# EAGLE design HotPotato (EAGLE 8.6.1)
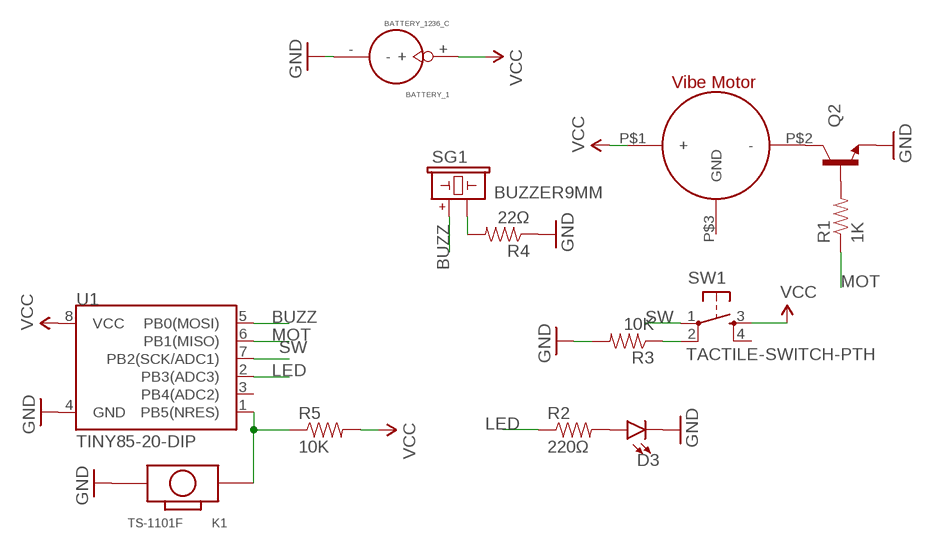
[diagram p0: schematic, sheet 1]

## Parts
BATTERY_1  BATTERY_1236_C  [BATTERY_1236_C]
D3  LED5MM-KIT  [LED_5MM-KIT]
K1  TS-1101F  DIP-BUTTON-FRONT-WHITE(2P-3.4X6MM)  [SW2-3.4X6.0X3.55MM-90D]
M1  SANYO_NRS-2574SMT  [SMT]
Q2  TRANSISTOR_NPNBC547  [TO-92-AMMO]
R1  1K  RESISTOR1206  [1206]
R2  220Ω  RESISTOR1206  [1206]
R3  10K  RESISTOR1206  [1206]
R4  22Ω  RESISTOR1206  [1206]
R5  10K  RESISTOR1206  [1206]
SG1  BUZZER9MM  [BUZZER-9MM-PTH_NEW]
SW1  TACTILE-SWITCH-PTH  [TAC-SWITCH-PTH]
U1  TINY85-20-DIP  ATTINY45TINY85-20-DIP  [DIP08]

## Nets
BUZZ: SG1.P$1 U1.5(PB0(MOSI))
GND: BATTERY_1.- D3.K(C) K1.P$2 Q2.3(E) R3.2 R4.1 U1.4(GND)
LED: R2.1 U1.2(PB3(ADC3))
MOT: R1.1 U1.6(PB1(MISO))
N$1: R3.1 SW1.2
N$2: D3.A R2.2
N$3: M1.P$2(-) Q2.1(C)
N$4: Q2.2(B) R1.2
N$5: R4.2 SG1.P$2
N$6: K1.P$1 R5.1 U1.1(PB5(NRES))
SW: SW1.1 U1.7(PB2(SCK/ADC1))
VCC: BATTERY_1.+ M1.P$1(+) R5.2 SW1.3 U1.8(VCC)
Unconnected: M1.P$3(GND) SW1.4 U1.3(PB4(ADC2))

## Library data of the parts
BATTERY_1 = Itead_BP_110825.lbr:BATTERY_1236_C: SOC004
D3 = SparkFun-LED:LED: LED (Generic) Standard schematic elements and footprints for 5mm, 3mm, 1206, and 0603 sized LEDs. Generic LEDs with no color specified.
K1 = Seeed-OPL-Button:DIP-BUTTON-FRONT-WHITE(2P-3.4X6MM): 311020025; MPN: TS-1101F
M1 = dhgoldberg:SANYO_NRS-2574: Surface mount vibrating motor.
Q2 = SparkFun-DiscreteSemi:TRANSISTOR_NPN: Generic NPN BJT MMBT2222A - TRANS-08049 (SOT-23, 1A 40V) MPSA42 - TRANS-09116 (SOT-23, 500mA 300V) MMBT5088LT1G - TRANS-11160 (SOT-23, 50 mA 30V) BC547 - COM-08928 <http://www.sparkfun.com/products/8928> (TO-92 45V 100mA) (1.Collector 2.Base 3.Emitter) 2N3904 - COM-00521 <http://www.sparkfun.com/products/521> (TO-92 40V 200mA) (1.Emitter 2.Base 3.Collector) P2N2222A - COM-12852 <http://www.sparkfun.com/products/12852> (TO-92 40V 600mA) (1.Collector 2.Base 3.Emitter)
R1-R5 = SparkFun-Passives:RESISTOR: Resistor Basic schematic elements and footprints for 0603, 1206, and PTH resistors.
SG1 = dhgoldberg:BUZZER: Buzzer
SW1 = GeekAmmo:TACTILE-SWITCH: Tactile Switch 4 Pins, SPST NO
U1 = SparkFun-DigitalIC:ATTINY45: Atmel 8-pin 2/4/8kB flash uC; PROD_ID: IC-09445

## Board
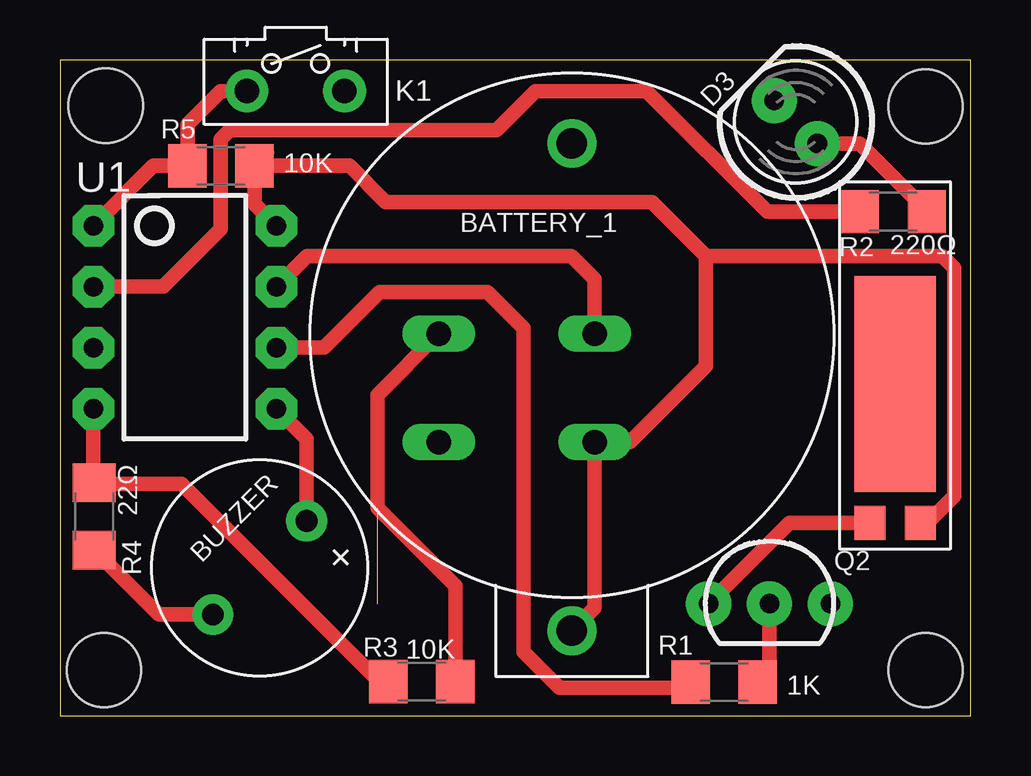
[diagram p1: board, top side]
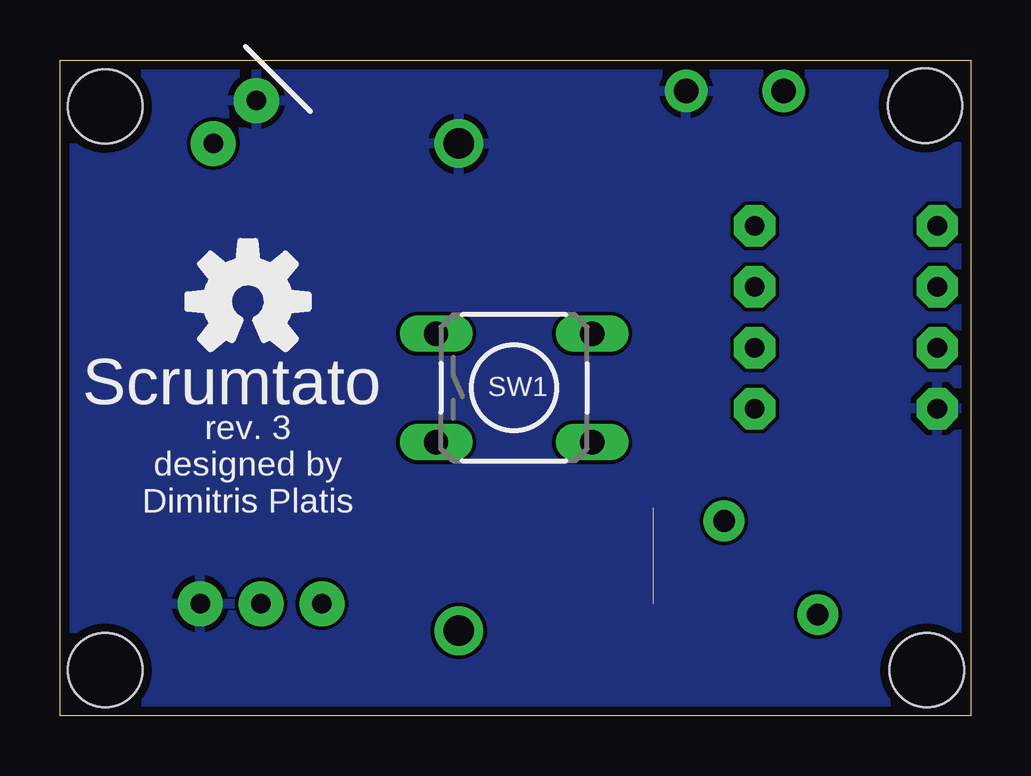
[diagram p2: board, bottom side, seen from below]

Size 37.97 x 27.34 mm. Coordinates in mm from the lower left corner, seen from the top.
Outline: 0,0 37.97,0 37.97,27.34 0,27.34 0,0
Copper layers (1*16): Top 0.0356mm / dielectric 1.5011mm / Bottom 0.0356mm
Design rules "LaenPCBOrder": minimum track width 6mil, minimum drill 13mil, track to track 6mil, track to pad 6mil, pad to pad 6mil, via to via 6mil, smd to smd 6mil, copper to edge 15mil, drill to drill 6mil, minimum pad ring 7mil, minimum via ring 7mil, stop-mask expansion 3mil, vias tented up to drill 0mil, thermal gap 10mil
Holes 3.1 mm at 1.91,25.43 36.08,1.91 36.08,25.41 1.83,1.91

### Footprints (pad centres in the part's own frame; a part is rotated, then mirrored left to right if it is on the bottom)
BATTERY_1236_C = drill 1.27 pad 2.032: + 0,0; - 0,20.32
LED_5MM-KIT = drill 0.813 pad 1.88: A -1.27,0; K 1.27,0
SW2-3.4X6.0X3.55MM-90D = drill 1.016 pad 1.778: P$1 2.032,-0.127; P$2 -2.032,-0.127
SMT = smd 1.4 x 1.3: P$1 6.7,0.95; P$2 6.7,-1.15 | smd 9 x 3.4: P$3 0.9,-0.1
TO-92-AMMO = drill 0.813 pad 1.88: 1 -2.54,0; 2 0,0; 3 2.54,0
1206 = smd 1.6 x 1.8: 1 -1.4,0; 2 1.4,0
BUZZER-9MM-PTH_NEW = drill 0.9 pad 1.7: P$1 -2.762,0; P$2 2.762,0
TAC-SWITCH-PTH = drill 1.016 pad 1.524 long: 1 -3.251,2.261; 2 3.251,2.261; 3 -3.251,-2.261; 4 3.251,-2.261
DIP08 = drill 0.813 pad 1.727 octagon: 1 -3.81,-3.81; 2 -1.27,-3.81; 3 1.27,-3.81; 4 3.81,-3.81; 5 3.81,3.81; 6 1.27,3.81; 7 -1.27,3.81; 8 -3.81,3.81

### Placement (x,y rotation side)
BATTERY_1  21.34,3.54 0 top
D3  30.67,24.75 135 top
K1  9.83,25.92 180 top
M1  34.91,14.74 270 top
Q2  29.58,4.67 0 top
R1  27.69,1.41 0 top
R2  34.73,21.02 0 top
R3  15.08,1.42 180 top
R4  1.42,8.31 270 top
R5  6.71,22.93 0 top
SG1  8.33,6.17 225 top
SW1  19.03,13.67 0 bottom
U1  5.2,16.61 270 top
U$1  [OSHWLOGO_BACK_0.2]  30.13,17.27 0 top

### Tracks (layer width: path | path; a pad name or v marks a point on that pad's centre or on a via)
BUZZ
  Top 0.61: U1.5 10.28,11.53 SG1.P$1
GND
  Top 0.61: U1.4 1.39,9.74 R4.1 1.47,9.67 5.08,9.67 13.33,1.42 R3.2
  pour Bottom: -0.17,27.17 38.33,27.17 38.33,0.17 -0.17,0.17
LED
  Top 0.61: U1.2 4.29,17.88 6.7,20.3 6.7,24.05 7.08,24.42 18.2,24.42 19.83,26.05 24.45,26.05 29.48,21.02 R2.1
MOT
  Top 0.61: U1.6 11,15.34 13.33,17.67 17.83,17.67 19.33,16.17 19.33,2.67 20.83,1.17 26.05,1.17 R1.1
N$1  (1 unrouted)
  Top 0.61: SW1.2 13.23,13.38 13.23,8.67 16.48,5.42 R3.1
N$2
  Top 0.61: R2.2 36.14,21.06 33.34,23.85 D3.A
N$3
  Top 0.61: Q2.1 30.41,8.04 M1.P$2
N$4
  Top 0.61: R1.2 29.58,1.9 Q2.2
N$5
  Top 0.61: R4.2 4.12,4.22 SG1.P$2
N$6
  Top 0.61: U1.1 3.89,22.93 R5.1 5.33,22.95 5.33,24.67 6.71,26.05 K1.P$1
SW
  Top 0.61: U1.7 10.3,19.17 21.33,19.17 22.29,18.21 SW1.1
VCC
  Top 0.61: U1.8 8.11,21.32 R5.2 | 8.63,23.47 8.11,22.95 R5.2 | M1.P$1 36.15,8.04 37.28,9.17 37.28,18.67 36.78,19.17 26.93,19.17 | BATTERY_1.+ 22.29,4.49 SW1.3 23.77,11.41 26.93,14.57 26.93,19.17 | R5.2 12.08,22.93 13.58,21.42 24.68,21.42 26.93,19.17

### Text on the board
tPlace: BUZZER
bPlace: Scrumtato | rev. 3 / designed by / Dimitris Platis